# Altium schematic sheet LED_Indicator.SchDoc
size A4; SheetNumber: 10; SheetTotal: 14
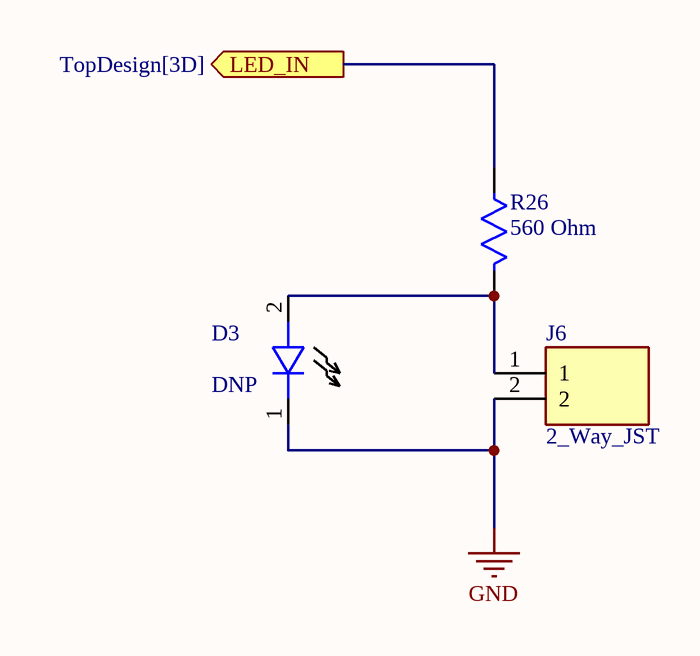
[diagram p0: LED_Indicator.SchDoc]

## Parts
D3  DNP  [LED SMD 0603]
J6  2_Way_JST  [2_Way_JST_Connector]
R26  560 Ohm  [Res_0603]

## Ports
LED_IN (out, see TopDesign[3D])

## Nets
GND: D3.1 J6.2
LED_IN: R26.2 ; port LED_IN
NetD3_2: D3.2 J6.1 R26.1

## Library data of the parts
D3 = LED SMD: SMD LED
J6 = 2_Way_JST_Connector: Connector Header Through Hole 2 position 0.098 (2.50mm); MF: JST Sales; MP: B2B-XH-A(LF)(SN); Value: *; Check_prices: https://www.snapeda.com/parts/B2B-XH-A(LF)(SN)/JST%20Sales%20America%20Inc./view-part/492310/?ref=eda; Price: None; Package: None; Availability: In Stock; SnapEDA_Link: https://www.snapeda.com/parts/B2B-XH-A(LF)(SN)/JST%20Sales%20America%20Inc./view-part/492310/?ref=snap
R26 = Res smd: SMD Resistor; MP: RC0805FR-07330RL; MF: Yageo; Package: 2012 Rohm Semiconductor; Value: *; SnapEDA_Link: https://www.snapeda.com/parts/RC0805FR-07330RL/Yageo/view-part/106115/?ref=snap; Price: None; Availability: Unavailable